# Altium schematic sheet Mounting_PCB_A.SchDoc
size A4
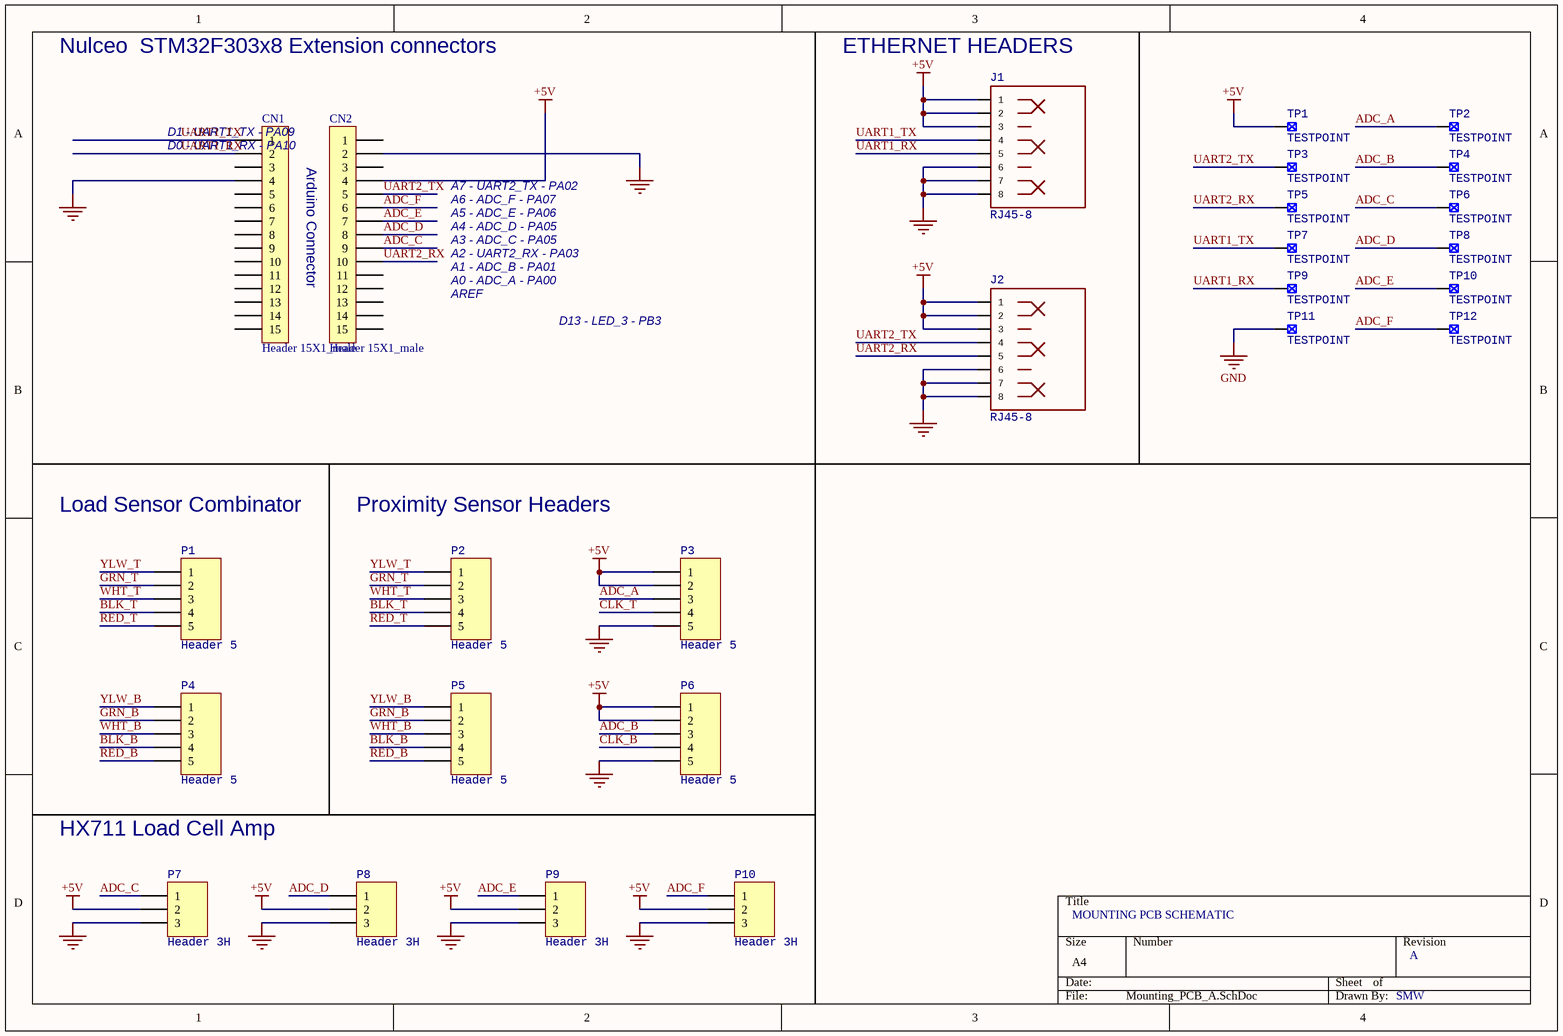
[diagram p0: Mounting_PCB_A.SchDoc]

## Parts
CN1  Header 15X1_male  [HDR_1x15_2R54_V_F]
CN2  Header 15X1_male  [HDR_1x15_2R54_V_F]
J1  RJ45-8  [RJ45-8]
J2  RJ45-8  [RJ45-8]
P1  Header 5  [HDR1X5]
P2  Header 5  [HDR1X5]
P3  Header 5  [HDR1X5]
P4  Header 5  [HDR1X5]
P5  Header 5  [HDR1X5]
P6  Header 5  [HDR1X5]
P7  Header 3H  [HDR1X3H]
P8  Header 3H  [HDR1X3H]
P9  Header 3H  [HDR1X3H]
P10  Header 3H  [HDR1X3H]
TP1  TESTPOINT  [TP70]
TP2  TESTPOINT  [TP70]
TP3  TESTPOINT  [TP70]
TP4  TESTPOINT  [TP70]
TP5  TESTPOINT  [TP70]
TP6  TESTPOINT  [TP70]
TP7  TESTPOINT  [TP70]
TP8  TESTPOINT  [TP70]
TP9  TESTPOINT  [TP70]
TP10  TESTPOINT  [TP70]
TP11  TESTPOINT  [TP70]
TP12  TESTPOINT  [TP70]

## Nets
+5V: CN2.4 J1.1 J1.2 J1.3 J2.1 J2.2 J2.3 P3.1 P3.2 P6.1 P6.2 P7.2 P8.2 P9.2 P10.2 TP1.1
GND: CN1.4 CN2.2 J1.6 J1.7 J1.8 J2.6 J2.7 J2.8 P3.5 P6.5 P7.3 P8.3 P9.3 P10.3 TP11.1
ADC_A: P3.3 TP2.1
ADC_B: P6.3 TP4.1
ADC_C: CN2.9 P7.1 TP6.1
ADC_D: CN2.8 P8.1 TP8.1
ADC_E: CN2.7 P9.1 TP10.1
ADC_F: CN2.6 P10.1 TP12.1
BLK_B: P4.4 P5.4
BLK_T: P1.4 P2.4
CLK_B: P6.4
CLK_T: P3.4
GRN_B: P4.2 P5.2
GRN_T: P1.2 P2.2
RED_B: P4.5 P5.5
RED_T: P1.5 P2.5
UART1_RX: CN1.2 J1.5 TP9.1
UART1_TX: CN1.1 J1.4 TP7.1
UART2_RX: CN2.10 J2.5 TP5.1
UART2_TX: CN2.5 J2.4 TP3.1
WHT_B: P4.3 P5.3
WHT_T: P1.3 P2.3
YLW_B: P4.1 P5.1
YLW_T: P1.1 P2.1

Not connected (* = marked no-connect by the designer): CN1 3 5 6 7 8 9 10 11 12 13 14 15; CN2 1 3 11 12 13 14 15

## Notes on the sheet
- Nulceo  STM32F303x8 Extension connectors
- (near J1) ETHERNET HEADERS
- D1 - UART1_TX - PA09
- D0 - UART1_RX - PA10
- Arduino Connector
- A3 - ADC_C - PA05
- A4 - ADC_D - PA05
- A5 - ADC_E - PA06
- A6 - ADC_F - PA07
- A7 - UART2_TX - PA02
- A0 - ADC_A - PA00
- A1 - ADC_B - PA01
- A2 - UART2_RX - PA03
- AREF
- D13 - LED_3 - PB3
- Load Sensor Combinator
- Proximity Sensor Headers
- HX711 Load Cell Amp
- MOUNTING PCB SCHEMATIC
- A
- SMW

## Library data of the parts
CN1 CN2 = Header 15X1_Female_1: Header, 10-Pin, Single row,female; LatestRevisionDate: 17-Jul-2002; LatestRevisionNote: Re-released for DXP Platform.; Publisher: Altium Limited
J1 J2 = RJ45-8: PROD_ID: CONN-08506; SF_ID: PRT-00643
P1-P6 = Header 5: Header, 5-Pin; LatestRevisionDate: 17-Jul-2002; LatestRevisionNote: Re-released for DXP Platform.; Publisher: Altium Limited
P7-P10 = Header 3H: Header, 3-Pin, Right Angle; LatestRevisionDate: 17-Jul-2002; LatestRevisionNote: Re-released for DXP Platform.; Publisher: Altium Limited
TP1-TP12 = TESTPOINT: Test Point